# EAGLE design rony_servo (EAGLE 8.2.0)
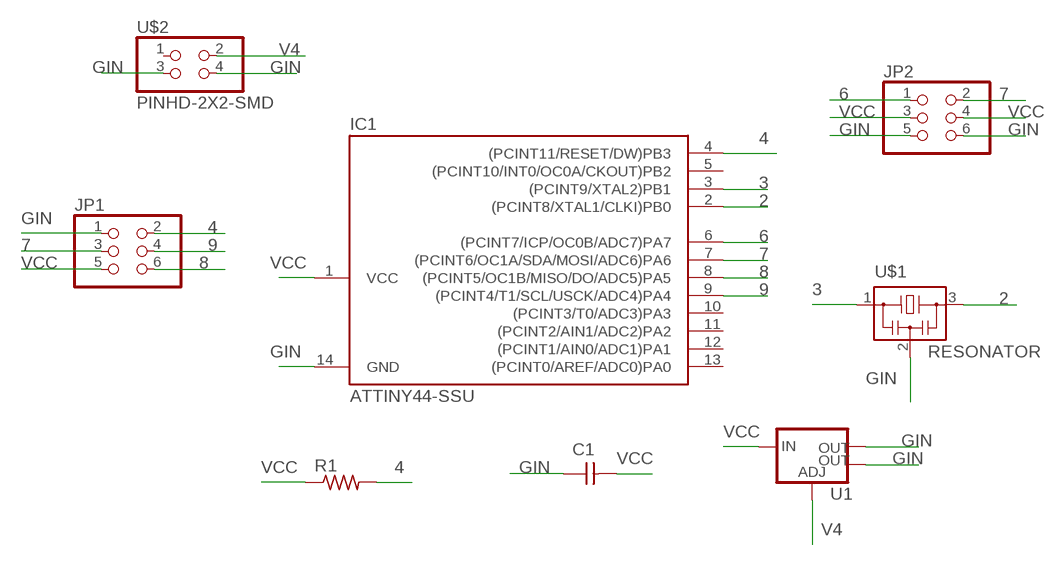
[diagram p0: schematic, sheet 1]

## Parts
C1  CAP-UNPOLARIZEDFAB  [C1206FAB]
IC1  ATTINY44-SSU  [SOIC14]
JP1  PINHD-2X3-SMD  [2X03SMD]
JP2  PINHD-2X3-SMD  [2X03SMD]
R1  RES-US1206FAB  [R1206FAB]
U1  V_REG_LM1117SOT223  [SOT223]
U$1  RESONATOR  [EFOBM]
U$2  PINHD-2X2-SMD  [2X02SMD]

## Nets
2: IC1.2((PCINT8/XTAL1/CLKI)PB0) U$1.3
3: IC1.3((PCINT9/XTAL2)PB1) U$1.1
4: IC1.4((PCINT11/RESET/DW)PB3) JP1.2 R1.2
6: IC1.6((PCINT7/ICP/OC0B/ADC7)PA7) JP2.1
7: IC1.7((PCINT6/OC1A/SDA/MOSI/ADC6)PA6) JP1.3 JP2.2
8: IC1.8((PCINT5/OC1B/MISO/DO/ADC5)PA5) JP1.6
9: IC1.9((PCINT4/T1/SCL/USCK/ADC4)PA4) JP1.4
GIN: C1.1 IC1.14(GND) JP1.1 JP2.5 JP2.6 U1.2(OUT) U1.4(OUT) U$1.2 U$2.3 U$2.4
V4: U1.1(ADJ) U$2.2
VCC: C1.2 IC1.1(VCC) JP1.5 JP2.3 JP2.4 R1.1 U1.3(IN)
Unconnected: IC1.5((PCINT10/INT0/OC0A/CKOUT)PB2) IC1.10((PCINT3/T0/ADC3)PA3) IC1.11((PCINT2/AIN1/ADC2)PA2) IC1.12((PCINT1/AIN0/ADC1)PA1) IC1.13((PCINT0/AREF/ADC0)PA0) U$2.1

## Library data of the parts
C1 = fab:CAP-UNPOLARIZED
IC1 = fab:ATTINY44
JP1 JP2 = fab:PINHD-2X3-SMD: PIN HEADER
R1 = fab:RES-US: Resistor (US Symbol) Variants with postfix FAB are widened to allow the routing of internal traces
U1 = fab:V_REG_LM1117: Voltage Regulator LM1117 Standard adjustable voltage regulator but in SMD form. Spark Fun Electronics SKU : COM-00595; PROD_ID: VREG-08170
U$1 = fab:RESONATOR
U$2 = fab:PINHD-2X2-SMD

## Board
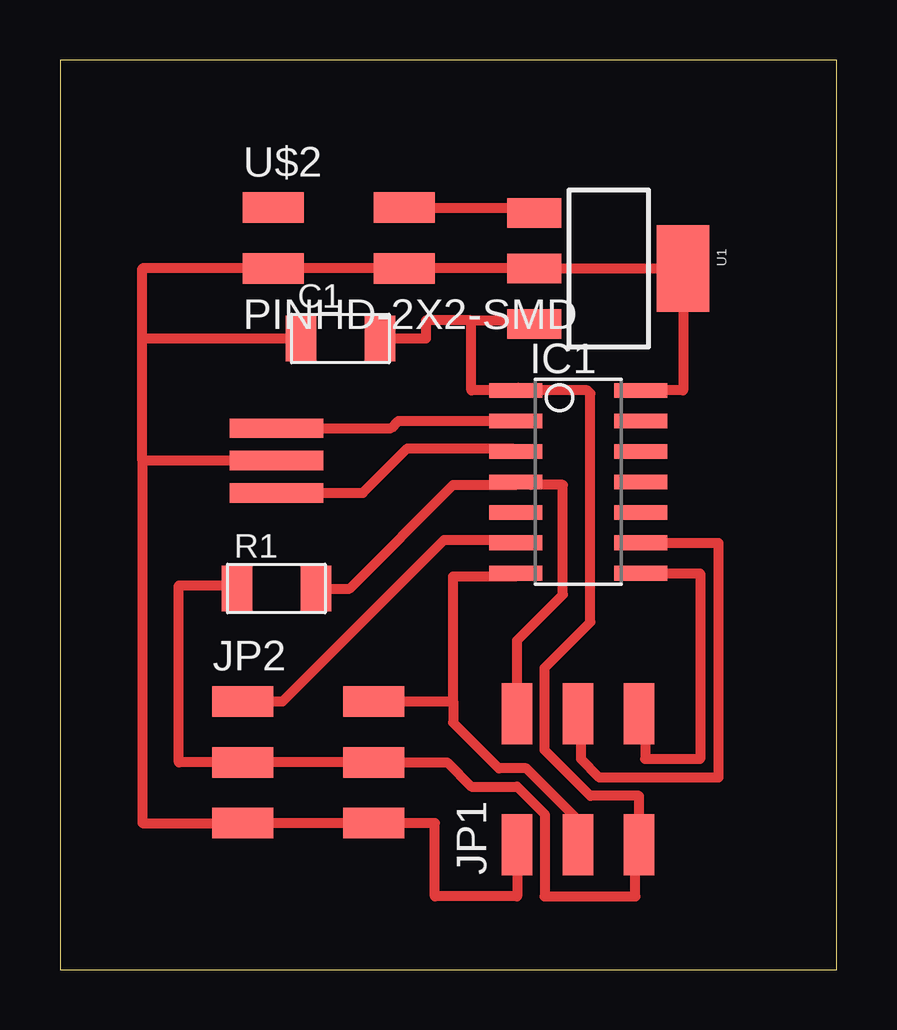
[diagram p1: board, top side]
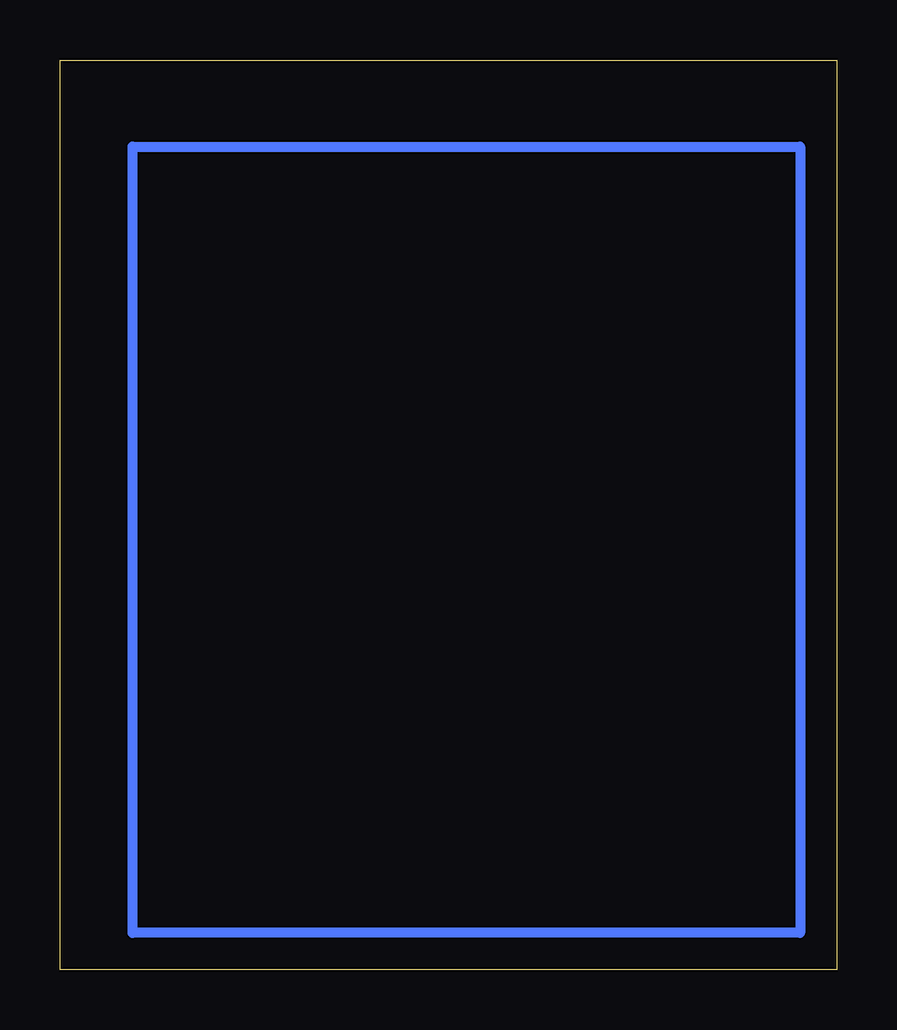
[diagram p2: board, bottom side, seen from below]

Size 32.37 x 37.9 mm. Coordinates in mm from the lower left corner, seen from the top.
Outline: 0,0 32.37,0 32.37,37.9 0,37.9 0,0
Copper layers (1*16): Top 0.035mm / dielectric 1.5mm / Bottom 0.035mm
Design rules "default": minimum track width 6mil, minimum drill 0.35mm, track to track 6mil, track to pad 6mil, pad to pad 6mil, via to via 6mil, smd to smd 6mil, copper to edge 40mil, drill to drill 6mil, minimum pad ring 10mil, minimum via ring 8mil, stop-mask expansion 4mil, vias tented up to drill 0mil, thermal gap 10mil

### Footprints (pad centres in the part's own frame; a part is rotated, then mirrored left to right if it is on the bottom)
C1206FAB = smd 1.27 x 1.905: 1 -1.651,0; 2 1.651,0
SOIC14 = smd 0.61 x 2.21: 1 -3.81,-2.603; 2 -2.54,-2.603; 3 -1.27,-2.603; 4 0,-2.603; 5 1.27,-2.603; 6 2.54,-2.603; 7 3.81,-2.603; 8 3.81,2.603; 9 2.54,2.603; 10 1.27,2.603; 11 0,2.603; 12 -1.27,2.603; 13 -2.54,2.603; 14 -3.81,2.603
2X03SMD = smd 2.54 x 1.27: 1 -2.54,2.54; 2 2.92,2.54; 3 -2.54,0; 4 2.92,0; 5 -2.54,-2.54; 6 2.92,-2.54
R1206FAB = smd 1.27 x 1.905: 1 -1.651,0; 2 1.651,0
SOT223 = smd 1.219 x 2.235: 1 -2.311,-3.099; 2 0,-3.099; 3 2.311,-3.099 | smd 3.6 x 2.2: 4 0,3.099
EFOBM = smd 0.8 x 3.9: 1 -1.35,0; 2 0,0; 3 1.35,0
2X02SMD = smd 2.54 x 1.27: 1 -2.54,1.27; 2 2.92,1.27; 3 -2.54,-1.27; 4 2.92,-1.27

### Placement (x,y rotation side)
C1  11.68,26.29 0 top
IC1  21.59,20.32 270 top
JP1  21.59,7.75 90 top
JP2  10.16,8.64 0 top
R1  9.02,15.88 0 top
U1  22.86,29.21 270 top
U$1  9.02,21.21 90 top
U$2  11.43,30.48 0 top

### Tracks (layer width: path | path; a pad name or v marks a point on that pad's centre or on a via)
2
  Top 0.152: 18.69,22.76 IC1.2
  Top 0.406: IC1.2 18.99,22.94 | U$1.3 13.8,22.56 14.1,22.86 18.59,22.86 18.69,22.76
3
  Top 0.406: 18.99,21.51 IC1.3 18.86,21.72 14.48,21.72 12.62,19.86 U$1.1
4
  Top 0.152: 19.51,20.32 IC1.4 | 19.1,10.97 JP1.2
  Top 0.406: JP1.2 19.05,13.72 20.95,15.62 20.95,20.19 19.63,20.19 19.51,20.32 | R1.2 12.06,15.88 16.38,20.19 18.99,20.19 IC1.4
6
  Top 0.406: 7.62,11.43 JP2.1 9.27,11.18 16,17.91 18.99,17.91 IC1.6
7
  Top 0.152: IC1.7 18.69,16.26 | 13.41,10.97 JP2.2 | 21.54,6.1 21.54,5.28 JP1.3
  Top 0.406: JP1.3 21.59,6.22 19.43,8.38 18.29,8.38 16.38,10.29 16.38,11.05 16.38,11.18 | 16.38,11.18 16.38,16.38 18.99,16.38 IC1.7 | JP2.2 16.38,11.18
8
  Top 0.152: 24.38,16.26 IC1.8 | 24.38,10.97 JP1.6
  Top 0.406: JP1.6 24.38,10.67 24.38,8.76 26.67,8.76 26.67,16.51 IC1.8
9
  Top 0.152: 23.98,17.88 IC1.9 | JP1.4 21.95,10.97
  Top 0.406: IC1.9 27.43,17.78 27.43,8 22.48,8 21.72,8.76 21.72,10.54 JP1.4
GIN
  Top 0.152: 10.16,26.01 C1.1
  Top 0.406: 3.43,26.29 3.43,29.21 U$2.3 U$2.4 U1.2 U1.4 25.96,24.13 IC1.14 | 3.43,21.21 3.43,26.29 | 3.43,21.21 3.43,6.1 JP2.5 JP2.6 15.62,6.1 15.62,3.05 19.05,3.05 JP1.1 | C1.1 3.43,26.29 | U$1.2 3.43,21.21
N$1
  Bottom 0.406: 1.52,1.52 29.34,1.52 29.34,34.29 1.52,34.29 1.52,1.52
V4
  Top 0.406: U$2.2 19.76,31.75 U1.1
VCC
  Top 0.152: 19.1,24.38 IC1.1 | 19.1,27.23 U1.3 | 23.98,4.88 JP1.5 23.98,5.28 | 13.41,8.53 JP2.4
  Top 0.406: C1.2 15.24,26.29 15.24,27.05 17.14,27.05 | 17.14,27.05 19.76,27.05 U1.3 | 23.98,4.88 23.98,3.05 20.19,3.05 20.19,6.48 19.05,7.62 17.14,7.62 16.13,8.64 JP2.4 JP2.3 4.95,8.64 4.95,16 7.37,16 R1.1 | JP1.5 24.13,7.24 22.1,7.24 20.19,9.14 20.19,12.57 22.1,14.48 22.1,24 21.97,24.13 IC1.1 17.14,24.13 17.14,27.05